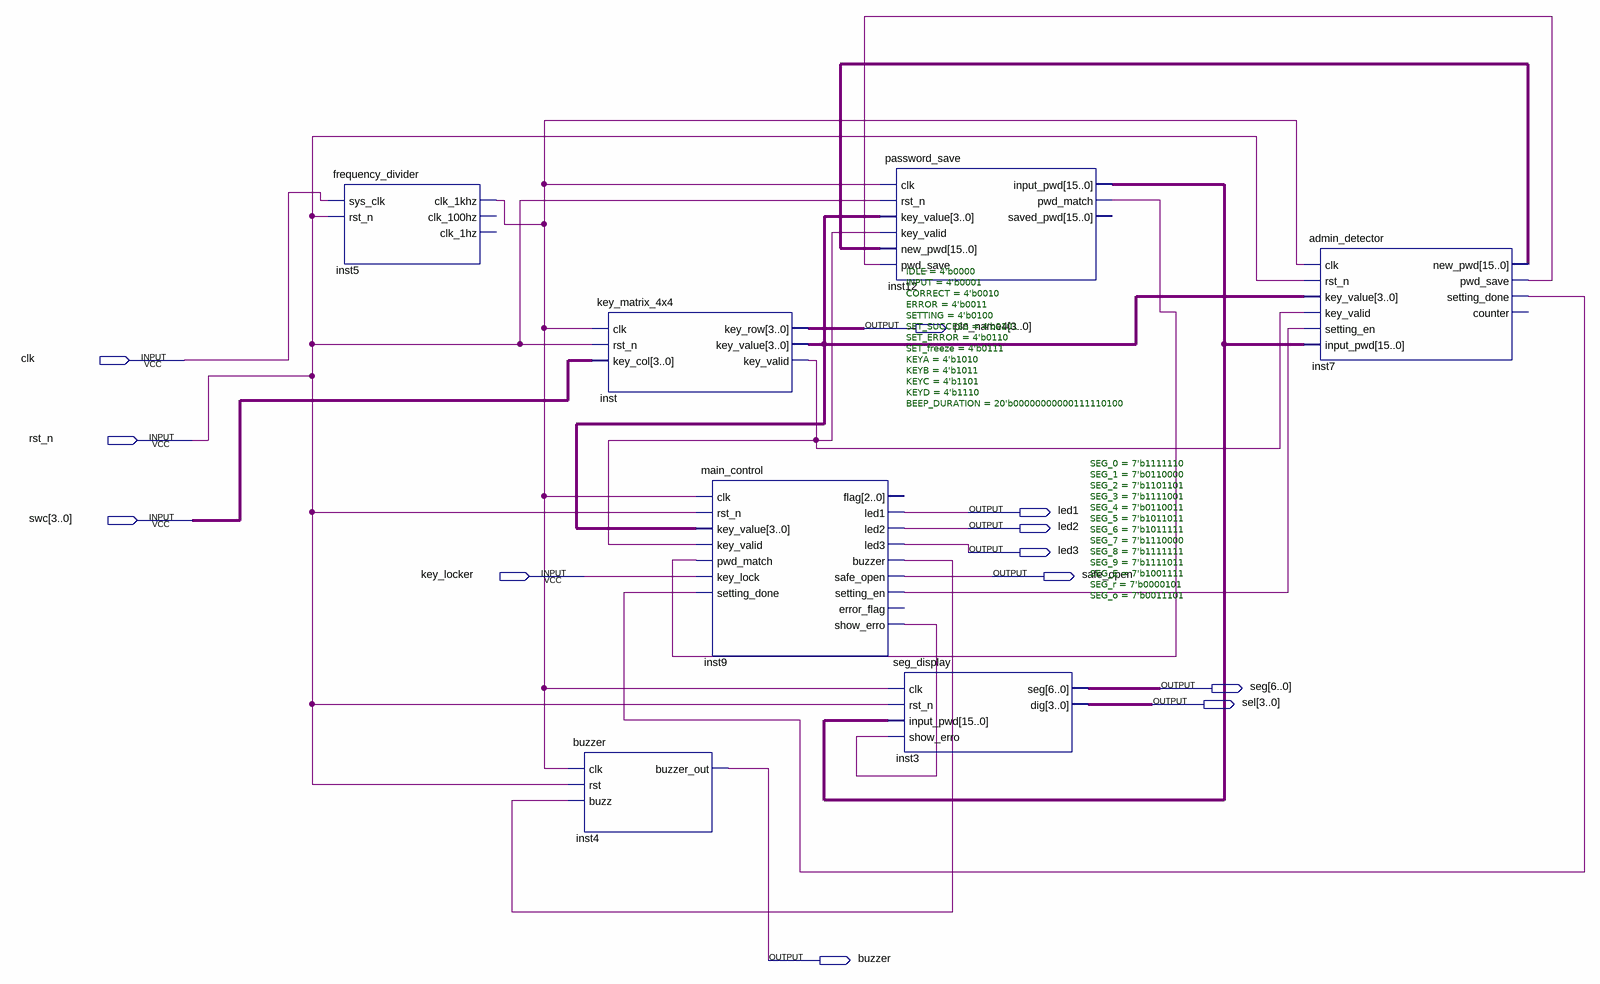
[diagram p0: schematic sheet]
// Quartus schematic Block1.bdf as structural Verilog: 7 symbols, 12 pins
module Block1 (
  input  clk,
  input  rst_n,
  input  [3:0] swc,
  input  key_locker,
  output [3:0] pin_name4,
  output led1,
  output led2,
  output led3,
  output safe_open,
  output [6:0] seg,
  output [3:0] sel,
  output buzzer
);

  wire inst5_clk_1khz, inst7_pwd_save, inst7_setting_done, inst9_buzzer, inst9_setting_en, inst9_show_erro,
       inst12_pwd_match, inst_key_valid;
  wire [3:0] inst_key_value;
  wire [15:0] inst7_new_pwd, inst12_input_pwd;

  frequency_divider inst5 (.sys_clk(clk), .rst_n(rst_n), .clk_1khz(inst5_clk_1khz));  // open: clk_100hz, clk_1hz
  key_matrix_4x4 inst (
    .clk(inst5_clk_1khz), .rst_n(rst_n), .key_col(swc), .key_row(pin_name4), .key_value(inst_key_value),
    .key_valid(inst_key_valid));
  buzzer inst4 (.clk(inst5_clk_1khz), .rst(rst_n), .buzz(inst9_buzzer), .buzzer_out(buzzer));
  main_control #(.IDLE(4'b0000), .INPUT(4'b0001), .CORRECT(4'b0010), .ERROR(4'b0011), .SETTING(4'b0100), .SET_SUCCESS(4'b0101), .SET_ERROR(4'b0110), .SET_freeze(4'b0111), .KEYA(4'b1010), .KEYB(4'b1011), .KEYC(4'b1101), .KEYD(4'b1110), .BEEP_DURATION(20'b00000000000111110100)) inst9 (
    .clk(inst5_clk_1khz), .rst_n(rst_n), .key_value(inst_key_value), .key_valid(inst_key_valid),
    .pwd_match(inst12_pwd_match), .key_lock(key_locker), .setting_done(inst7_setting_done), .led1(led1),
    .led2(led2), .led3(led3), .buzzer(inst9_buzzer), .safe_open(safe_open), .setting_en(inst9_setting_en),
    .show_erro(inst9_show_erro));  // open: flag, error_flag
  password_save inst12 (
    .clk(inst5_clk_1khz), .rst_n(rst_n), .key_value(inst_key_value), .key_valid(inst_key_valid),
    .new_pwd(inst7_new_pwd), .pwd_save(inst7_pwd_save), .input_pwd(inst12_input_pwd),
    .pwd_match(inst12_pwd_match));  // open: saved_pwd
  seg_display #(.SEG_0(7'b1111110), .SEG_1(7'b0110000), .SEG_2(7'b1101101), .SEG_3(7'b1111001), .SEG_4(7'b0110011), .SEG_5(7'b1011011), .SEG_6(7'b1011111), .SEG_7(7'b1110000), .SEG_8(7'b1111111), .SEG_9(7'b1111011), .SEG_E(7'b1001111), .SEG_r(7'b0000101), .SEG_o(7'b0011101)) inst3 (
    .clk(inst5_clk_1khz), .rst_n(rst_n), .input_pwd(inst12_input_pwd), .show_erro(inst9_show_erro),
    .seg(seg), .dig(sel));
  admin_detector inst7 (
    .clk(inst5_clk_1khz), .rst_n(rst_n), .key_value(inst_key_value), .key_valid(inst_key_valid),
    .setting_en(inst9_setting_en), .input_pwd(inst12_input_pwd), .new_pwd(inst7_new_pwd),
    .pwd_save(inst7_pwd_save), .setting_done(inst7_setting_done));  // open: counter
endmodule
